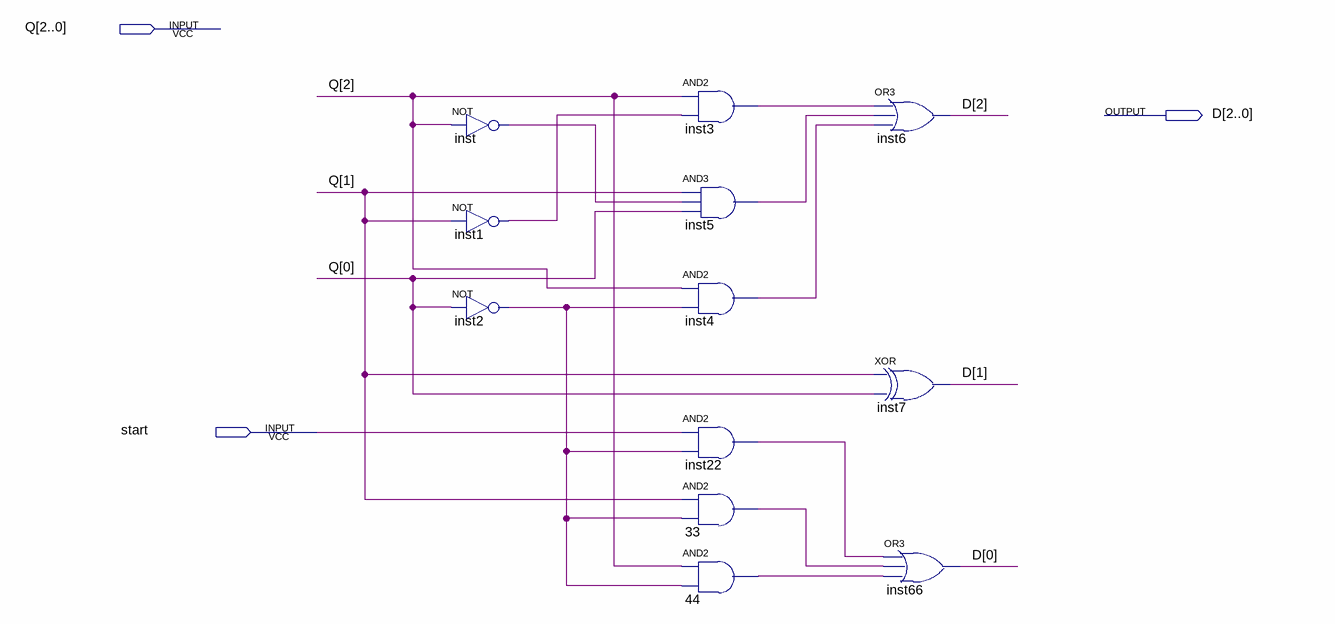
[diagram p0: schematic sheet]
// Quartus schematic next_state.bdf as structural Verilog: 12 symbols, 3 pins
module next_state (
  input  [2:0] Q,
  input  start,
  output [2:0] D
);

  wire inst1_out, inst2_out, inst3_out, inst4_out, inst5_out, inst22_out, inst_out, n33_out, n44_out;

  not inst (inst_out, Q[2]);
  not inst1 (inst1_out, Q[1]);
  not inst2 (inst2_out, Q[0]);
  and inst3 (inst3_out, Q[2], inst1_out);
  and inst5 (inst5_out, Q[1], inst_out, Q[0]);
  and inst4 (inst4_out, Q[2], inst2_out);
  and inst22 (inst22_out, start, inst2_out);
  and u_33 (n33_out, Q[1], inst2_out);
  and u_44 (n44_out, Q[2], inst2_out);
  or inst6 (D[2], inst3_out, inst5_out, inst4_out);
  xor inst7 (D[1], Q[1], Q[0]);
  or inst66 (D[0], inst22_out, n33_out, n44_out);
endmodule
